# EAGLE schematic DC_Current (EAGLE 6.4)
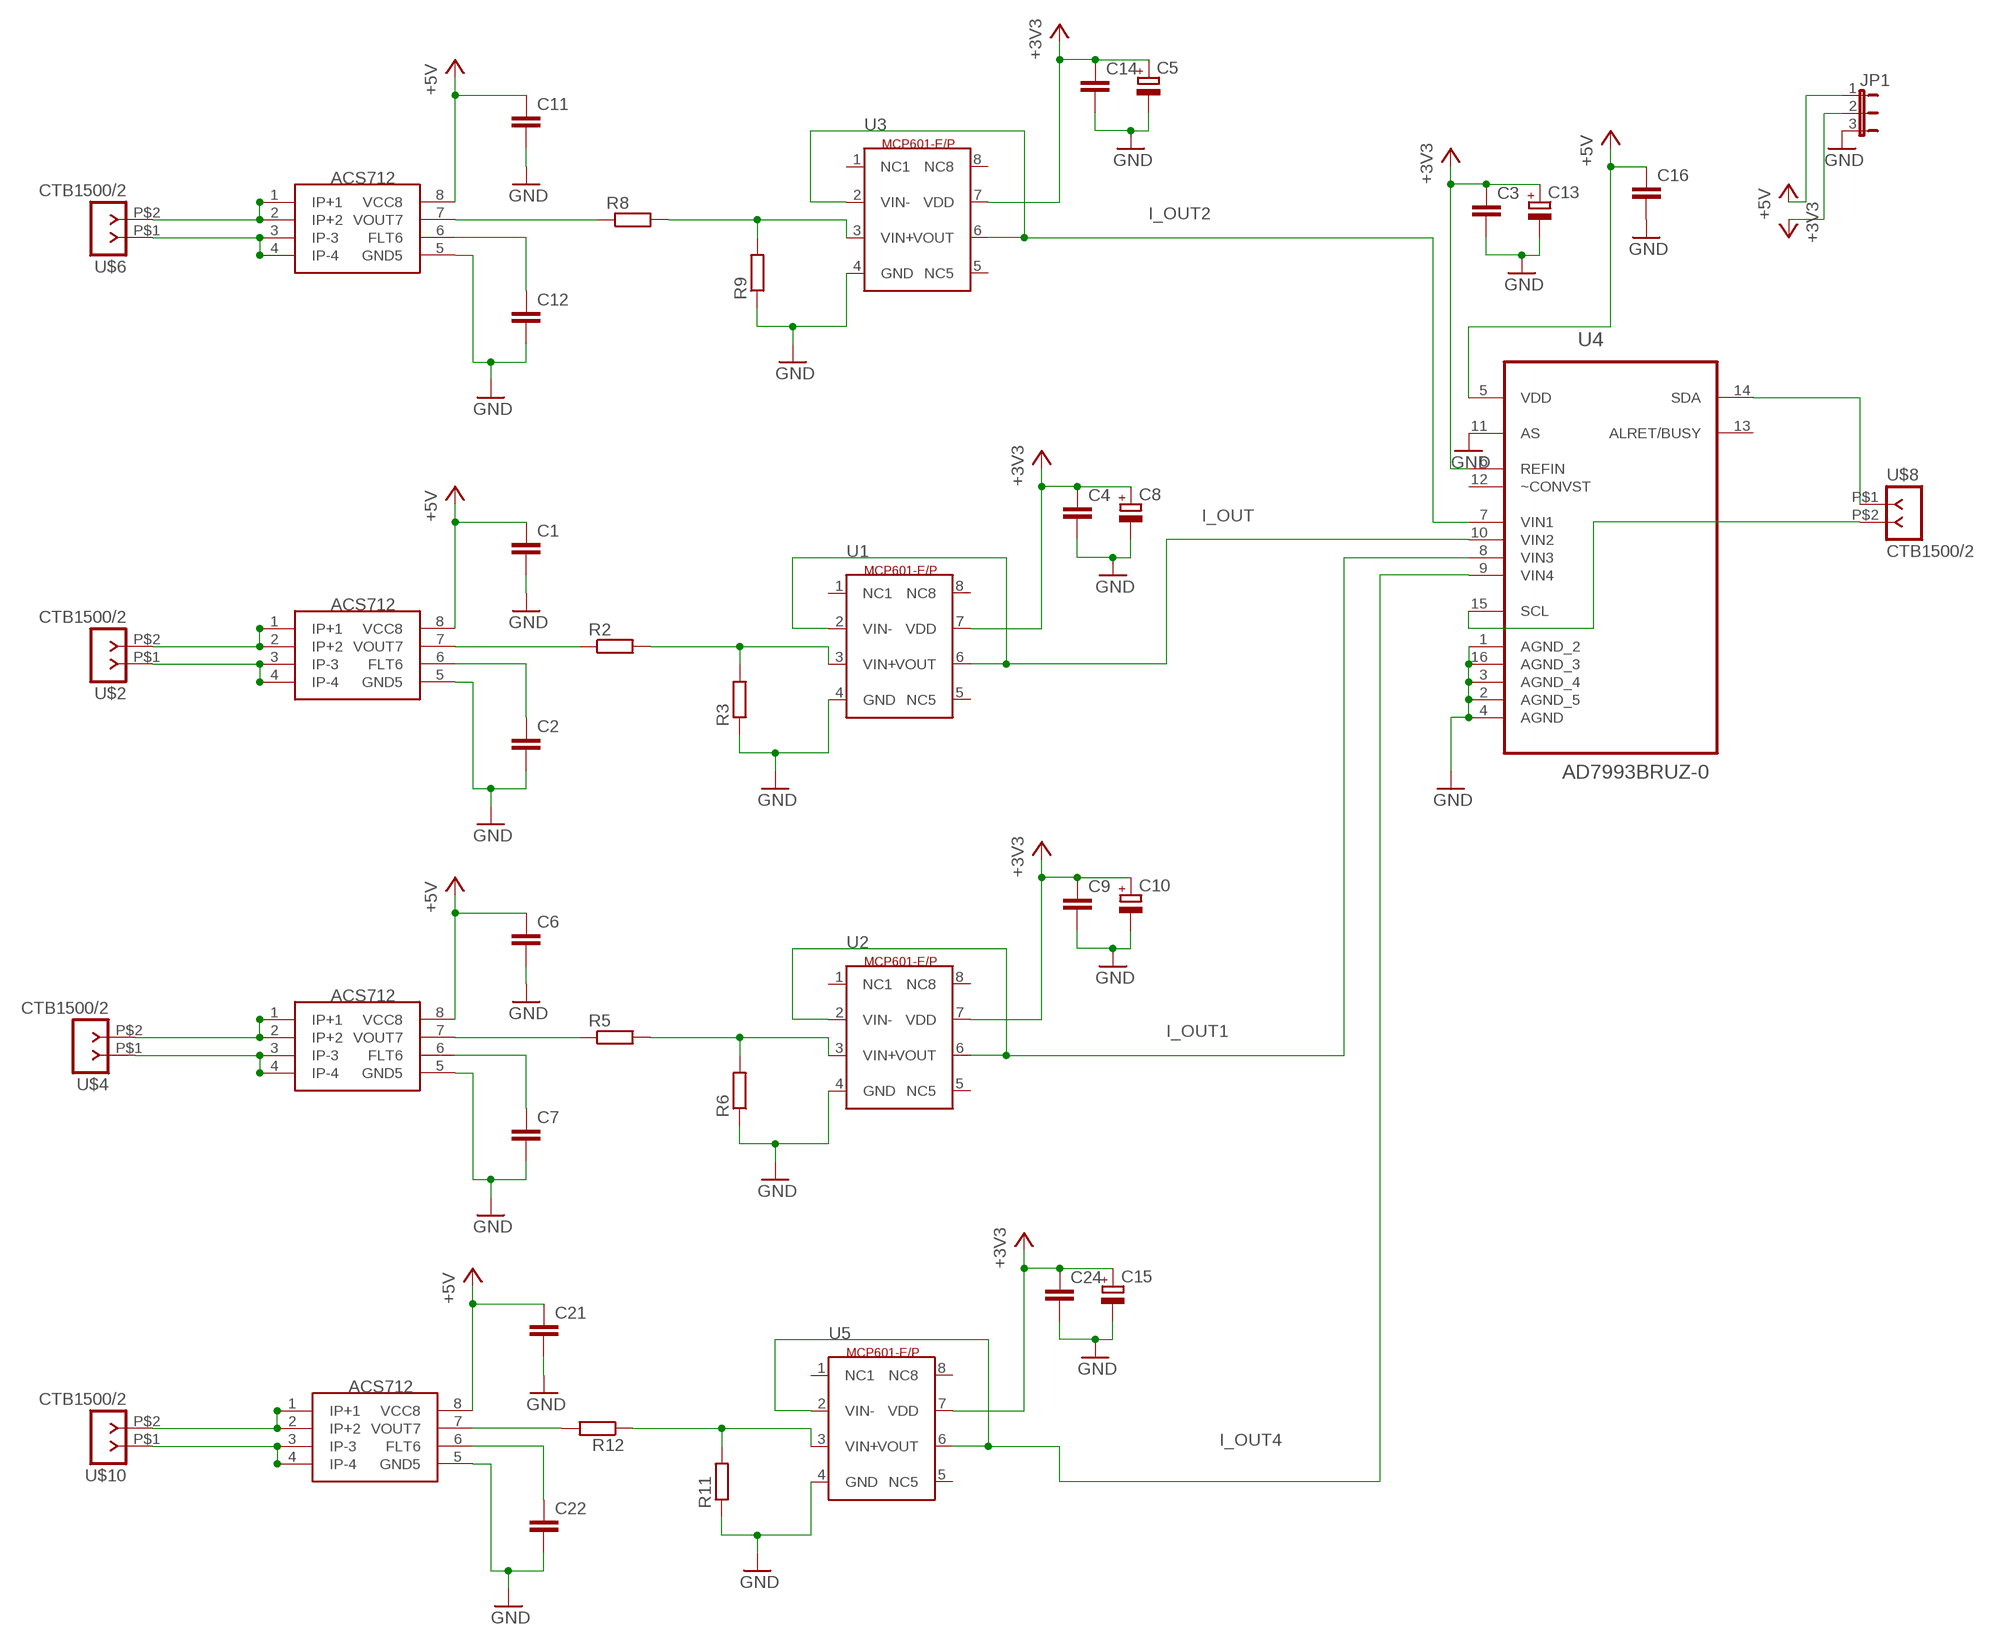
[diagram p0: schematic, sheet 1]

## Parts
C1  C-EU025-024X044  [C025-024X044]
C2  C-EU025-024X044  [C025-024X044]
C3  C-EU025-024X044  [C025-024X044]
C4  C-EU025-024X044  [C025-024X044]
C5  CPOL-EUE2-4  [E2-4]
C6  C-EU025-024X044  [C025-024X044]
C7  C-EU025-024X044  [C025-024X044]
C8  CPOL-EUE2-4  [E2-4]
C9  C-EU025-024X044  [C025-024X044]
C10  CPOL-EUE2-4  [E2-4]
C11  C-EU025-024X044  [C025-024X044]
C12  C-EU025-024X044  [C025-024X044]
C13  CPOL-EUE2-4  [E2-4]
C14  C-EU025-024X044  [C025-024X044]
C15  CPOL-EUE2-4  [E2-4]
C16  C-EU025-025X050  [C025-025X050]
C21  C-EU025-024X044  [C025-024X044]
C22  C-EU025-024X044  [C025-024X044]
C24  C-EU025-024X044  [C025-024X044]
JP1  JP2E  [JP2]
R2  R-EU_0207/7  [0207/7]
R3  R-EU_0207/7  [0207/7]
R5  R-EU_0207/7  [0207/7]
R6  R-EU_0207/7  [0207/7]
R8  R-EU_0207/7  [0207/7]
R9  R-EU_0207/7  [0207/7]
R11  R-EU_0207/7  [0207/7]
R12  R-EU_0207/7  [0207/7]
U1  MCP601  [SO8]
U2  MCP601  [SO8]
U3  MCP601  [SO8]
U4  AD7993BRUZ-0  [SOP65P640X120-16N]
U5  MCP601  [SO8]
U$1  ACS712  [SO8]
U$2  CTB1500/2  [CTB1500-2]
U$3  ACS712  [SO8]
U$4  CTB1500/2  [CTB1500-2]
U$5  ACS712  [SO8]
U$6  CTB1500/2  [CTB1500-2]
U$8  CTB1500/2  [CTB1500-2]
U$9  ACS712  [SO8]
U$10  CTB1500/2  [CTB1500-2]

## Nets
+3V3: C3.1 C4.1 C5.+ C8.+ C9.1 C10.+ C13.+ C14.1 C15.+ C24.1 JP1.2 U1.7(VDD) U2.7(VDD) U3.7(VDD) U4.6(REFIN) U5.7(VDD)
+5V: C1.1 C6.1 C11.1 C16.1 C21.1 JP1.1 U4.5(VDD) U$1.8(VCC8) U$3.8(VCC8) U$5.8(VCC8) U$9.8(VCC8)
GND: C1.2 C2.2 C3.2 C4.2 C5.- C6.2 C7.2 C8.- C9.2 C10.- C11.2 C12.2 C13.- C14.2 C15.- C16.2 C21.2 C22.2 C24.2 JP1.3 R3.1 R6.1 R9.1 R11.1 U1.4(GND) U2.4(GND) U3.4(GND) U4.1(AGND_2) U4.2(AGND_5) U4.3(AGND_4) U4.4(AGND) U4.11(AS) U4.16(AGND_3) U5.4(GND) U$1.5(GND5) U$3.5(GND5) U$5.5(GND5) U$9.5(GND5)
I_OUT: U1.2(VIN-) U1.6(VOUT) U4.10(VIN2)
I_OUT1: U2.2(VIN-) U2.6(VOUT) U4.8(VIN3)
I_OUT2: U3.2(VIN-) U3.6(VOUT) U4.7(VIN1)
I_OUT4: U4.9(VIN4) U5.2(VIN-) U5.6(VOUT)
N$2: U$1.3(IP-3) U$1.4(IP-4) U$2.P$1
N$4: C2.1 U$1.6(FLT6)
N$5: U$3.3(IP-3) U$3.4(IP-4) U$4.P$1
N$6: R2.1 U$1.7(VOUT7)
N$7: R8.1 U$5.7(VOUT7)
N$8: C7.1 U$3.6(FLT6)
N$9: R2.2 R3.2 U1.3(VIN+)
N$10: R5.1 U$3.7(VOUT7)
N$11: R12.2 U$9.7(VOUT7)
N$12: R5.2 R6.2 U2.3(VIN+)
N$14: U$5.3(IP-3) U$5.4(IP-4) U$6.P$1
N$15: C12.1 U$5.6(FLT6)
N$16: U$5.1(IP+1) U$5.2(IP+2) U$6.P$2
N$17: U$1.1(IP+1) U$1.2(IP+2) U$2.P$2
N$18: R8.2 R9.2 U3.3(VIN+)
N$19: U$3.1(IP+1) U$3.2(IP+2) U$4.P$2
N$20: U$9.1(IP+1) U$9.2(IP+2) U$10.P$2
N$22: U4.14(SDA) U$8.P$1
N$23: U4.15(SCL) U$8.P$2
N$26: U$9.3(IP-3) U$9.4(IP-4) U$10.P$1
N$27: C22.1 U$9.6(FLT6)
N$30: R11.2 R12.1 U5.3(VIN+)
Unconnected: U1.1(NC1) U1.5(NC5) U1.8(NC8) U2.1(NC1) U2.5(NC5) U2.8(NC8) U3.1(NC1) U3.5(NC5) U3.8(NC8) U4.12(~CONVST) U4.13(ALRET/BUSY) U5.1(NC1) U5.5(NC5) U5.8(NC8)

## Library data of the parts
C1-C4 C6 C7 C9 C11 C12 C14 C16 C21 C22 C24 = resistor:C-EU: CAPACITOR, European symbol
C5 C8 C10 C13 C15 = resistor:CPOL-EU: POLARIZED CAPACITOR, European symbol
JP1 = jumper:JP2E: JUMPER
R2 R3 R5 R6 R8 R9 R11 R12 = resistor:R-EU_: RESISTOR, European symbol
U1-U3 U5 = eko-parts:MCP601
U4 = ADC:AD7993BRUZ-0: ADC; MPN: AD7993BRUZ-0; OC_FARNELL: 1078309; OC_NEWARK: 59K6101; PACKAGE: TSSOP-16; SUPPLIER: Analog Devices
U$1 U$3 U$5 U$9 = eko-parts:ACS712
U$2 U$4 U$6 U$8 U$10 = eko-parts:CTB1500/2